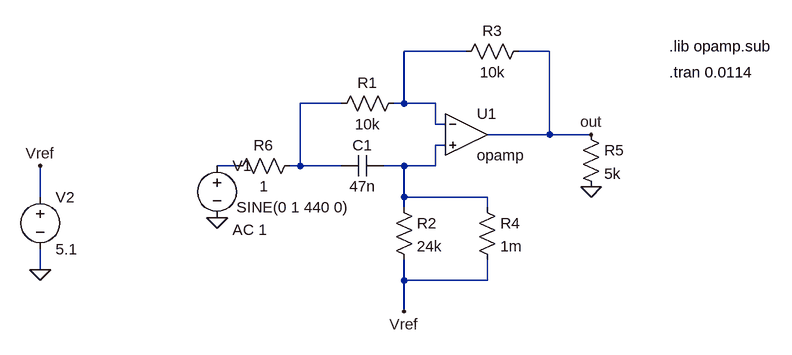
[diagram p0: schematic stage.asc]
stage.asc, the LTspice schematic file:
Version 4
SHEET 1 964 680
WIRE 416 128 320 128
WIRE 544 128 496 128
WIRE 224 208 160 208
WIRE 320 208 320 128
WIRE 320 208 304 208
WIRE 368 208 320 208
WIRE 368 240 368 208
WIRE 384 240 368 240
WIRE 544 256 544 128
WIRE 544 256 448 256
WIRE 608 256 544 256
WIRE 384 272 368 272
WIRE 64 304 32 304
WIRE 160 304 160 208
WIRE 160 304 144 304
WIRE 224 304 160 304
WIRE 320 304 288 304
WIRE 368 304 368 272
WIRE 368 304 320 304
WIRE -240 352 -240 304
WIRE 320 352 320 304
WIRE 448 352 320 352
WIRE 320 368 320 352
WIRE 448 368 448 352
WIRE -240 464 -240 432
WIRE 320 480 320 448
WIRE 448 480 448 448
WIRE 448 480 320 480
WIRE 320 528 320 480
FLAG 320 528 Vref
FLAG 608 256 out
FLAG 608 336 0
FLAG 32 384 0
FLAG -240 464 0
FLAG -240 304 Vref
SYMBOL res 320 192 R90
WINDOW 0 0 56 VBottom 2
WINDOW 3 32 56 VTop 2
SYMATTR InstName R1
SYMATTR Value 10k
SYMBOL res 304 352 R0
SYMATTR InstName R2
SYMATTR Value 24k
SYMBOL res 512 112 R90
WINDOW 0 0 56 VBottom 2
WINDOW 3 32 56 VTop 2
SYMATTR InstName R3
SYMATTR Value 10k
SYMBOL voltage 32 288 R0
WINDOW 123 24 114 Left 2
WINDOW 39 0 0 Left 0
WINDOW 3 30 80 Left 2
SYMATTR Value2 AC 1
SYMATTR Value SINE(0 1 440 0)
SYMATTR InstName V1
SYMBOL res 432 352 R0
SYMATTR InstName R4
SYMATTR Value 1m
SYMBOL res 592 240 R0
SYMATTR InstName R5
SYMATTR Value 5k
SYMBOL cap 288 288 R90
WINDOW 0 0 32 VBottom 2
WINDOW 3 32 32 VTop 2
SYMATTR InstName C1
SYMATTR Value 47n
SYMBOL res 160 288 R90
WINDOW 0 0 56 VBottom 2
WINDOW 3 32 56 VTop 2
SYMATTR InstName R6
SYMATTR Value 1
SYMBOL voltage -240 336 R0
SYMATTR InstName V2
SYMATTR Value 5.1
SYMBOL opamp 416 192 R0
SYMATTR InstName U1
TEXT 728 120 Left 2 !.lib opamp.sub
TEXT 728 160 Left 2 !.tran 0.0114

The netlist it stands for:
* stage.asc
R1 N001 N002 10k
R2 N003 Vref 24k
R3 out N001 10k
V1 N004 0 SINE(0 1 440 0) AC 1
R4 N003 Vref 1m
R5 out 0 5k
C1 N003 N002 47n
R6 N002 N004 1
V2 Vref 0 5.1
XU1 N001 N003 out opamp Aol=100K GBW=10Meg  ; pins invin noninvin out
.lib opamp.sub
.tran 0.0114
.backanno
.end